# Altium project ControlBoard.PrjPcb
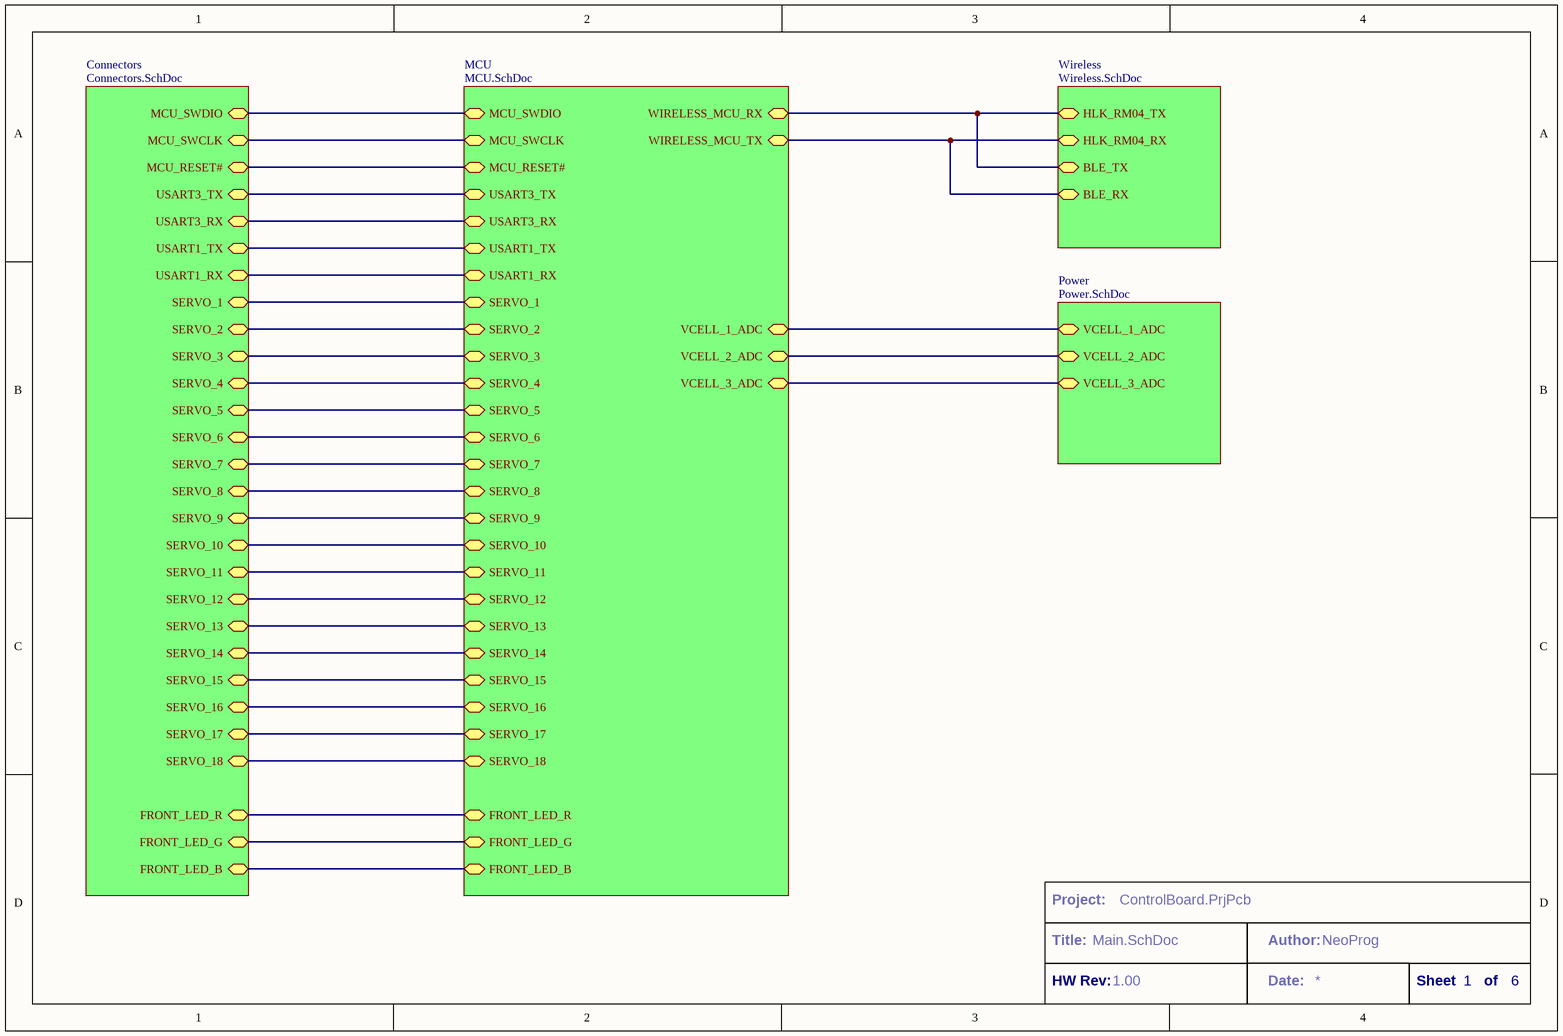
[diagram p0: Main.SchDoc]
ProjectAuthor: NeoProg; ProjectRevision: 1.00; ProjectStatus: D
5 sheets, 76 parts. Net scope: hierarchical (ports join the sheet entries above them; power ports are global).
Board file: PCB.PcbDoc
Sheets:
  Main.SchDoc
    Connectors = Connectors.SchDoc
    MCU = MCU.SchDoc
    Power = Power.SchDoc
    Wireless = Wireless.SchDoc

## Sheet Main.SchDoc
size A4; DocumentNumber: 1; SheetNumber: 1; SheetTotal: 6

### Sub-sheets
Connectors = Connectors.SchDoc: MCU_SWDIO, MCU_SWCLK, MCU_RESET#, USART3_TX, USART3_RX, USART1_TX, USART1_RX, SERVO_1, SERVO_2, SERVO_3, SERVO_4, SERVO_5, SERVO_6, SERVO_7, SERVO_8, SERVO_9, SERVO_10, SERVO_11, SERVO_12, SERVO_13, SERVO_14, SERVO_15, SERVO_16, SERVO_17, SERVO_18, FRONT_LED_B, FRONT_LED_G, FRONT_LED_R
MCU = MCU.SchDoc: MCU_SWDIO, MCU_SWCLK, MCU_RESET#, USART3_TX, USART3_RX, USART1_TX, USART1_RX, SERVO_1, SERVO_2, SERVO_3, SERVO_4, SERVO_5, SERVO_6, SERVO_7, SERVO_8, SERVO_9, SERVO_10, SERVO_11, SERVO_12, SERVO_13, SERVO_14, SERVO_15, SERVO_16, SERVO_17, SERVO_18, WIRELESS_MCU_TX, WIRELESS_MCU_RX, VCELL_1_ADC, VCELL_3_ADC, VCELL_2_ADC, FRONT_LED_R, FRONT_LED_G, FRONT_LED_B
Power = Power.SchDoc: VCELL_1_ADC, VCELL_3_ADC, VCELL_2_ADC
Wireless = Wireless.SchDoc: HLK_RM04_TX, HLK_RM04_RX, BLE_RX, BLE_TX

### Nets
BLE_RX: sheet MCU/WIRELESS_MCU_TX, sheet Wireless/HLK_RM04_RX, sheet Wireless/BLE_RX
BLE_TX: sheet MCU/WIRELESS_MCU_RX, sheet Wireless/HLK_RM04_TX, sheet Wireless/BLE_TX
FRONT_LED_B: sheet Connectors/FRONT_LED_B, sheet MCU/FRONT_LED_B
FRONT_LED_G: sheet Connectors/FRONT_LED_G, sheet MCU/FRONT_LED_G
FRONT_LED_R: sheet Connectors/FRONT_LED_R, sheet MCU/FRONT_LED_R
MCU_RESET#: sheet Connectors/MCU_RESET#, sheet MCU/MCU_RESET#
MCU_SWCLK: sheet Connectors/MCU_SWCLK, sheet MCU/MCU_SWCLK
MCU_SWDIO: sheet Connectors/MCU_SWDIO, sheet MCU/MCU_SWDIO
SERVO_1: sheet Connectors/SERVO_1, sheet MCU/SERVO_1
SERVO_2: sheet Connectors/SERVO_2, sheet MCU/SERVO_2
SERVO_3: sheet Connectors/SERVO_3, sheet MCU/SERVO_3
SERVO_4: sheet Connectors/SERVO_4, sheet MCU/SERVO_4
SERVO_5: sheet Connectors/SERVO_5, sheet MCU/SERVO_5
SERVO_6: sheet Connectors/SERVO_6, sheet MCU/SERVO_6
SERVO_7: sheet Connectors/SERVO_7, sheet MCU/SERVO_7
SERVO_8: sheet Connectors/SERVO_8, sheet MCU/SERVO_8
SERVO_9: sheet Connectors/SERVO_9, sheet MCU/SERVO_9
SERVO_10: sheet Connectors/SERVO_10, sheet MCU/SERVO_10
SERVO_11: sheet Connectors/SERVO_11, sheet MCU/SERVO_11
SERVO_12: sheet Connectors/SERVO_12, sheet MCU/SERVO_12
SERVO_13: sheet Connectors/SERVO_13, sheet MCU/SERVO_13
SERVO_14: sheet Connectors/SERVO_14, sheet MCU/SERVO_14
SERVO_15: sheet Connectors/SERVO_15, sheet MCU/SERVO_15
SERVO_16: sheet Connectors/SERVO_16, sheet MCU/SERVO_16
SERVO_17: sheet Connectors/SERVO_17, sheet MCU/SERVO_17
SERVO_18: sheet Connectors/SERVO_18, sheet MCU/SERVO_18
USART1_RX: sheet Connectors/USART1_RX, sheet MCU/USART1_RX
USART1_TX: sheet Connectors/USART1_TX, sheet MCU/USART1_TX
USART3_RX: sheet Connectors/USART3_RX, sheet MCU/USART3_RX
USART3_TX: sheet Connectors/USART3_TX, sheet MCU/USART3_TX
VCELL_1_ADC: sheet MCU/VCELL_1_ADC, sheet Power/VCELL_1_ADC
VCELL_2_ADC: sheet MCU/VCELL_2_ADC, sheet Power/VCELL_2_ADC
VCELL_3_ADC: sheet MCU/VCELL_3_ADC, sheet Power/VCELL_3_ADC

### Notes on the sheet
- Project:
- Title:
- HW Rev:
- Author:
- Date:
- Sheet
- of

## Sheet Connectors.SchDoc
size A4
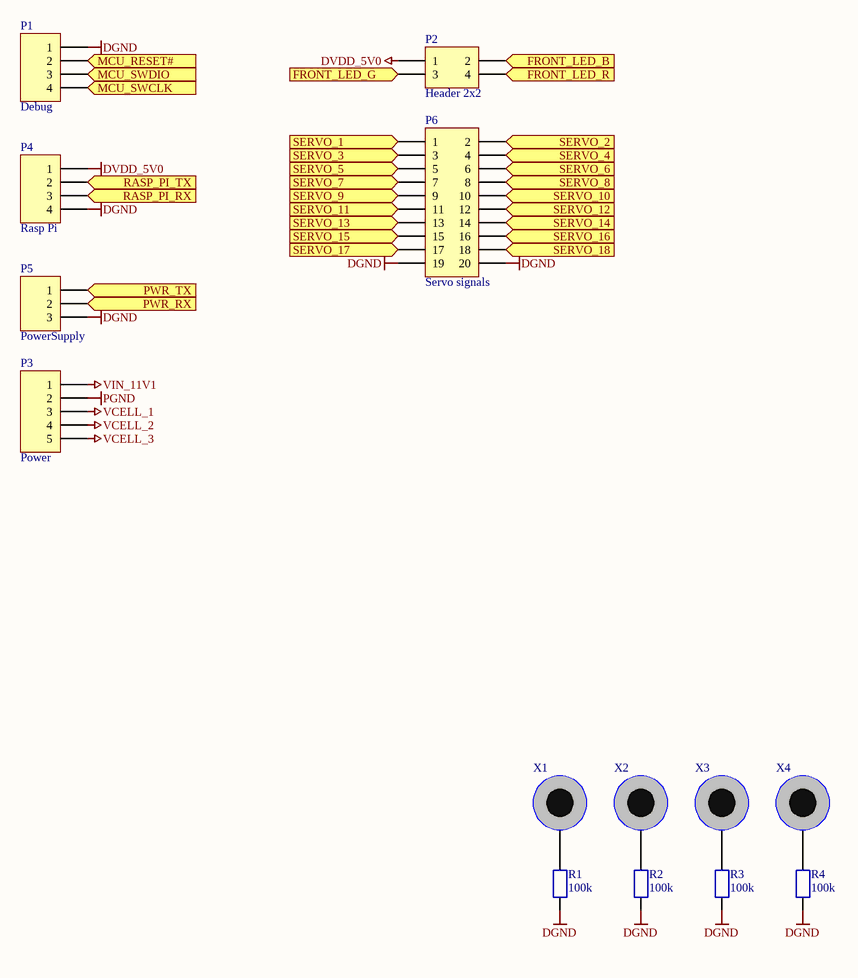
[diagram p1: Connectors.SchDoc]

### Parts
P1  Debug  [HDR_SMD_1X4_1.50]
P2  Header 2x2  [HDR_M_2X2_2.54]
P3  Power  [HDR_M_1X5_2.54_OUTLINE]
P4  Rasp Pi  [HDR_M_1X4_2.54]
P5  PowerSupply  [HDR_M_1X3_2.54]
P6  Servo signals  [HDR_M_2X10_2.54_OUTLINE]
R1  100k  [R_0603/1608]
R2  100k  [R_0603/1608]
R3  100k  [R_0603/1608]
R4  100k  [R_0603/1608]
X1  Mounting hole  [HOLE_M2_D4.0/2.5]  (value not drawn)  (no BOM)
X2  Mounting hole  [HOLE_M2_D4.0/2.5]  (value not drawn)  (no BOM)
X3  Mounting hole  [HOLE_M2_D4.0/2.5]  (value not drawn)  (no BOM)
X4  Mounting hole  [HOLE_M2_D4.0/2.5]  (value not drawn)  (no BOM)

### Ports
FRONT_LED_B, FRONT_LED_G, FRONT_LED_R, MCU_RESET#, MCU_SWCLK, MCU_SWDIO, PWR_RX, PWR_TX, RASP_PI_RX, RASP_PI_TX, SERVO_1, SERVO_2, SERVO_3, SERVO_4, SERVO_5, SERVO_6, SERVO_7, SERVO_8, SERVO_9, SERVO_10, SERVO_11, SERVO_12, SERVO_13, SERVO_14, SERVO_15, SERVO_16, SERVO_17, SERVO_18

### Nets
DGND: P1.1 P4.4 P5.3 P6.19 P6.20 R1.2 R2.2 R3.2 R4.2
DVDD_5V0: P2.1 P4.1
PGND: P3.2
VCELL_1: P3.3
VCELL_2: P3.4
VCELL_3: P3.5
VIN_11V1: P3.1
FRONT_LED_B: P2.2 ; port FRONT_LED_B
FRONT_LED_G: P2.3 ; port FRONT_LED_G
FRONT_LED_R: P2.4 ; port FRONT_LED_R
MCU_RESET#: P1.2 ; port MCU_RESET#
MCU_SWCLK: P1.4 ; port MCU_SWCLK
MCU_SWDIO: P1.3 ; port MCU_SWDIO
PWR_RX: P5.2 ; port PWR_RX
PWR_TX: P5.1 ; port PWR_TX
RASP_PI_RX: P4.3 ; port RASP_PI_RX
RASP_PI_TX: P4.2 ; port RASP_PI_TX
SERVO_1: P6.1 ; port SERVO_1
SERVO_2: P6.2 ; port SERVO_2
SERVO_3: P6.3 ; port SERVO_3
SERVO_4: P6.4 ; port SERVO_4
SERVO_5: P6.5 ; port SERVO_5
SERVO_6: P6.6 ; port SERVO_6
SERVO_7: P6.7 ; port SERVO_7
SERVO_8: P6.8 ; port SERVO_8
SERVO_9: P6.9 ; port SERVO_9
SERVO_10: P6.10 ; port SERVO_10
SERVO_11: P6.11 ; port SERVO_11
SERVO_12: P6.12 ; port SERVO_12
SERVO_13: P6.13 ; port SERVO_13
SERVO_14: P6.14 ; port SERVO_14
SERVO_15: P6.15 ; port SERVO_15
SERVO_16: P6.16 ; port SERVO_16
SERVO_17: P6.17 ; port SERVO_17
SERVO_18: P6.18 ; port SERVO_18
NetR1_1: R1.1 X1.1
NetR2_1: R2.1 X2.1
NetR3_1: R3.1 X3.1
NetR4_1: R4.1 X4.1

### Notes on the sheet
- Project:
- Title:
- HW Rev:
- Author:
- Date:
- Sheet
- of

### Library data of the parts
P1 P4 = Header 4: Header, 4-Pin; LatestRevisionDate: 17-Jul-2002; LatestRevisionNote: Re-released for DXP Platform.; Publisher: Altium Limited
P2 = Header 2x2: Header, 2-Pin; LatestRevisionDate: 17-Jul-2002; LatestRevisionNote: Re-released for DXP Platform.; Publisher: Altium Limited
P3 = Header 5: Header, 5-Pin; LatestRevisionDate: 17-Jul-2002; LatestRevisionNote: Re-released for DXP Platform.; Publisher: Altium Limited
P5 = Header 3: Header, 3-Pin; LatestRevisionDate: 17-Jul-2002; LatestRevisionNote: Re-released for DXP Platform.; Publisher: Altium Limited
P6 = Header 2x10: Header, 20-Pin; LatestRevisionDate: 17-Jul-2002; LatestRevisionNote: Re-released for DXP Platform.; Publisher: Altium Limited
R1-R4 = Resistor
X1-X4 = Mounting hole: Hole for screw M3, outline D6

## Sheet MCU.SchDoc
size A4
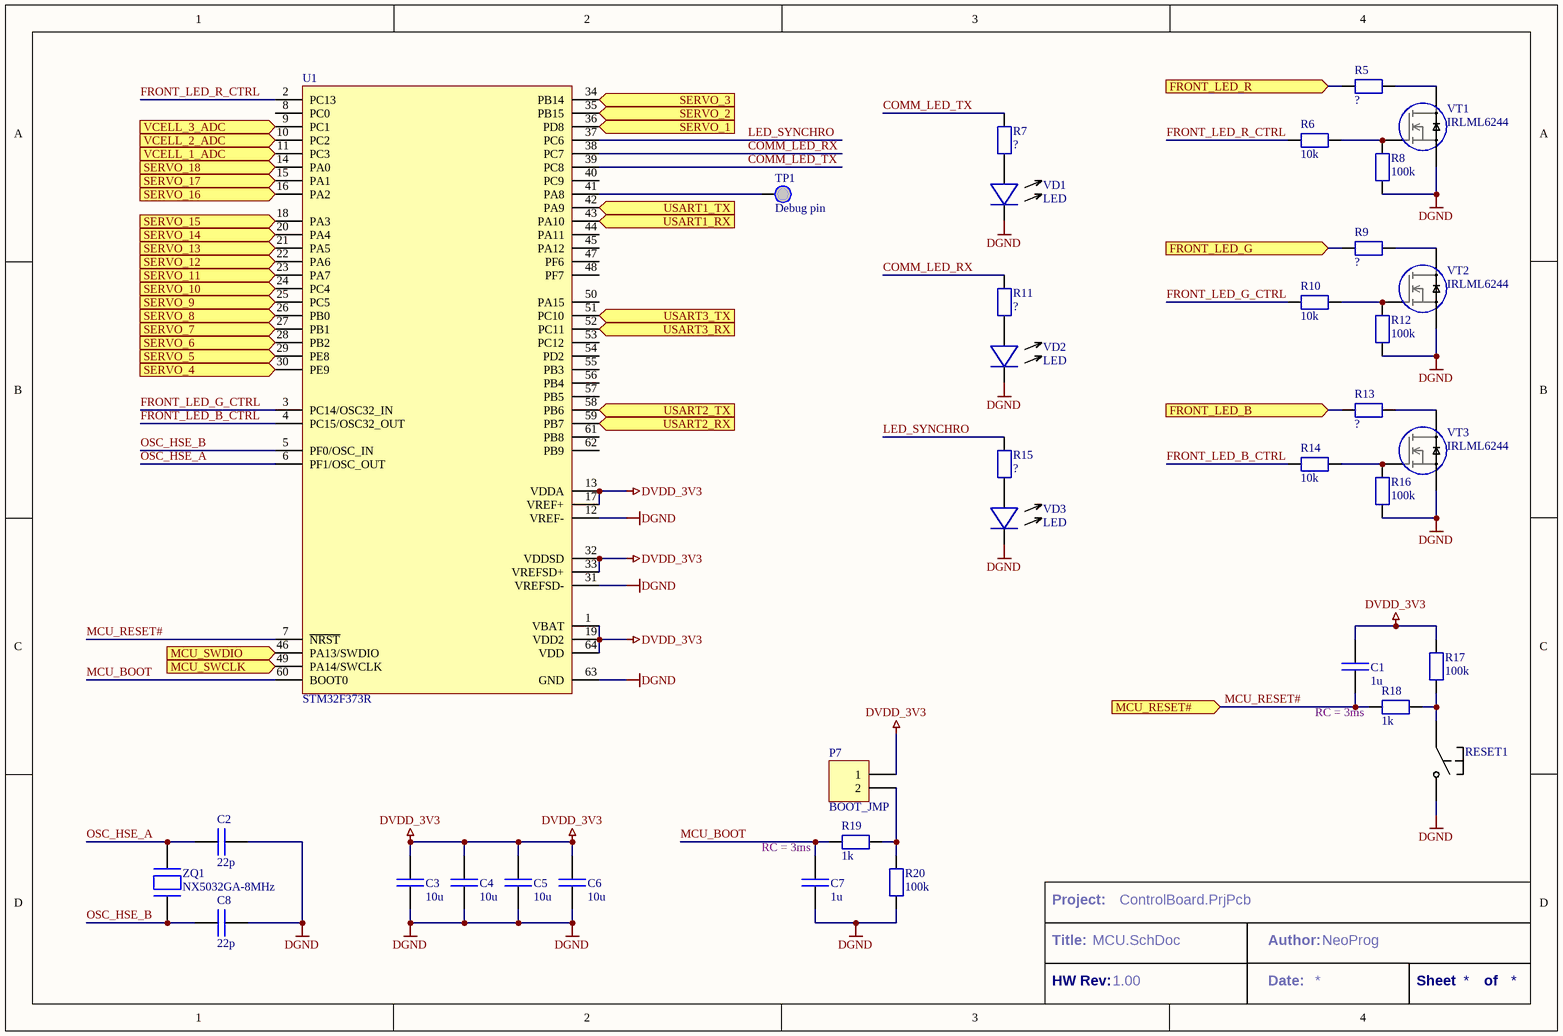
[diagram p2: MCU.SchDoc]

### Parts
C1  1u  [C_0603/1608]
C2  22p  [C_0603/1608]
C3  10u  [C_0603/1608]
C4  10u  [C_0603/1608]
C5  10u  [C_0603/1608]
C6  10u  [C_0603/1608]
C7  1u  [C_0603/1608]
C8  22p  [C_0603/1608]
P7  BOOT_JMP  [HDR_SMD_1X2_1.50]
R5  ?  [R_0603/1608]
R6  10k  [R_0603/1608]
R7  ?  [R_0603/1608]
R8  100k  [R_0603/1608]
R9  ?  [R_0603/1608]
R10  10k  [R_0603/1608]
R11  ?  [R_0603/1608]
R12  100k  [R_0603/1608]
R13  ?  [R_0603/1608]
R14  10k  [R_0603/1608]
R15  ?  [R_0603/1608]
R16  100k  [R_0603/1608]
R17  100k  [R_0603/1608]
R18  1k  [R_0603/1608]
R19  1k  [R_0603/1608]
R20  100k  [R_0603/1608]
RESET1  Button SPST  [BUTTON_SMD_6x6]  (value not drawn)
TP1  Debug pin  [TP_SMD_D1.00]  (no BOM)
U1  STM32F373R  [LQFP64]
VD1  LED  [LED_0603/1608]
VD2  LED  [LED_0603/1608]
VD3  LED  [LED_0603/1608]
VT1  IRLML6244  [SOT23-3]
VT2  IRLML6244  [SOT23-3]
VT3  IRLML6244  [SOT23-3]
ZQ1  NX5032GA-8MHz  [OSC_2PINS SMD]

### Ports
FRONT_LED_B, FRONT_LED_G, FRONT_LED_R, MCU_RESET#, MCU_SWCLK, MCU_SWDIO, SERVO_1, SERVO_2, SERVO_3, SERVO_4, SERVO_5, SERVO_6, SERVO_7, SERVO_8, SERVO_9, SERVO_10, SERVO_11, SERVO_12, SERVO_13, SERVO_14, SERVO_15, SERVO_16, SERVO_17, SERVO_18, USART1_RX, USART1_TX, USART2_RX, USART2_TX, USART3_RX, USART3_TX, VCELL_1_ADC, VCELL_2_ADC, VCELL_3_ADC

### Nets
DGND: C2.2 C3.2 C4.2 C5.2 C6.2 C7.2 C8.2 R8.1 R12.1 R16.1 R20.2 RESET1.2 U1.12(VREF-) U1.31(VREFSD-) U1.63(GND) VD1.C(Cathode) VD2.C(Cathode) VD3.C(Cathode) VT1.S VT2.S VT3.S
DVDD_3V3: C1.1 C3.1 C4.1 C5.1 C6.1 P7.1 R17.1 U1.1(VBAT) U1.13(VDDA) U1.17(VREF+) U1.19(VDD2) U1.32(VDDSD) U1.33(VREFSD+) U1.64(VDD)
COMM_LED_RX: R11.1 U1.38(PC7)
COMM_LED_TX: R7.1 U1.39(PC8)
FRONT_LED_B: R13.2 ; port FRONT_LED_B
FRONT_LED_B_CTRL: R14.2 U1.4(PC15/OSC32_OUT)
FRONT_LED_G: R9.2 ; port FRONT_LED_G
FRONT_LED_G_CTRL: R10.2 U1.3(PC14/OSC32_IN)
FRONT_LED_R: R5.2 ; port FRONT_LED_R
FRONT_LED_R_CTRL: R6.2 U1.2(PC13)
LED_SYNCHRO: R15.1 U1.37(PC6)
MCU_BOOT: C7.1 R19.2 U1.60(BOOT0)
MCU_RESET#: C1.2 R18.2 U1.7(~{NRST}) ; port MCU_RESET#
MCU_SWCLK: U1.49(PA14/SWCLK) ; port MCU_SWCLK
MCU_SWDIO: U1.46(PA13/SWDIO) ; port MCU_SWDIO
OSC_HSE_A: C2.1 U1.6(PF1/OSC_OUT) ZQ1.2
OSC_HSE_B: C8.1 U1.5(PF0/OSC_IN) ZQ1.1
SERVO_1: U1.36(PD8) ; port SERVO_1
SERVO_2: U1.35(PB15) ; port SERVO_2
SERVO_3: U1.34(PB14) ; port SERVO_3
SERVO_4: U1.30(PE9) ; port SERVO_4
SERVO_5: U1.29(PE8) ; port SERVO_5
SERVO_6: U1.28(PB2) ; port SERVO_6
SERVO_7: U1.27(PB1) ; port SERVO_7
SERVO_8: U1.26(PB0) ; port SERVO_8
SERVO_9: U1.25(PC5) ; port SERVO_9
SERVO_10: U1.24(PC4) ; port SERVO_10
SERVO_11: U1.23(PA7) ; port SERVO_11
SERVO_12: U1.22(PA6) ; port SERVO_12
SERVO_13: U1.21(PA5) ; port SERVO_13
SERVO_14: U1.20(PA4) ; port SERVO_14
SERVO_15: U1.18(PA3) ; port SERVO_15
SERVO_16: U1.16(PA2) ; port SERVO_16
SERVO_17: U1.15(PA1) ; port SERVO_17
SERVO_18: U1.14(PA0) ; port SERVO_18
USART1_RX: U1.43(PA10) ; port USART1_RX
USART1_TX: U1.42(PA9) ; port USART1_TX
USART2_RX: U1.59(PB7) ; port USART2_RX
USART2_TX: U1.58(PB6) ; port USART2_TX
USART3_RX: U1.52(PC11) ; port USART3_RX
USART3_TX: U1.51(PC10) ; port USART3_TX
VCELL_1_ADC: U1.11(PC3) ; port VCELL_1_ADC
VCELL_2_ADC: U1.10(PC2) ; port VCELL_2_ADC
VCELL_3_ADC: U1.9(PC1) ; port VCELL_3_ADC
NetP7_2: P7.2 R19.1 R20.1
NetR5_1: R5.1 VT1.D
NetR6_1: R6.1 R8.2 VT1.G
NetR7_2: R7.2 VD1.A(Anode)
NetR9_1: R9.1 VT2.D
NetR10_1: R10.1 R12.2 VT2.G
NetR11_2: R11.2 VD2.A(Anode)
NetR13_1: R13.1 VT3.D
NetR14_1: R14.1 R16.2 VT3.G
NetR15_2: R15.2 VD3.A(Anode)
NetR17_2: R17.2 R18.1 RESET1.1
NetTP1_1: TP1.1 U1.41(PA8)

Not connected (* = marked no-connect by the designer): U1 0(EP) 8(PC0) 40(PC9) 44(PA11) 45(PA12) 47(PF6) 48(PF7) 50(PA15) 53(PC12) 54(PD2) 55(PB3) 56(PB4) 57(PB5) 61(PB8) 62(PB9)

### Notes on the sheet
- (near R18) RC = 3ms
- RC = 3ms
- Project:
- Title:
- HW Rev:
- Author:
- Date:
- Sheet
- of

### Library data of the parts
C1-C8 = Capacitor: Non-polarized capacitor
P7 = Header 2: Header, 2-Pin; LatestRevisionDate: 17-Jul-2002; LatestRevisionNote: Re-released for DXP Platform.; Publisher: Altium Limited
R5-R20 = Resistor
RESET1 = Button SPST: Button SPST, without fixation
TP1 = Test point
U1 = STM32F373R: 32-bit Cortex-M3
VT1-VT3 = MOSFET N: pin to pad: D>3 G>1 S>2
ZQ1 = Crystal oscillator

## Sheet Power.SchDoc
size A4
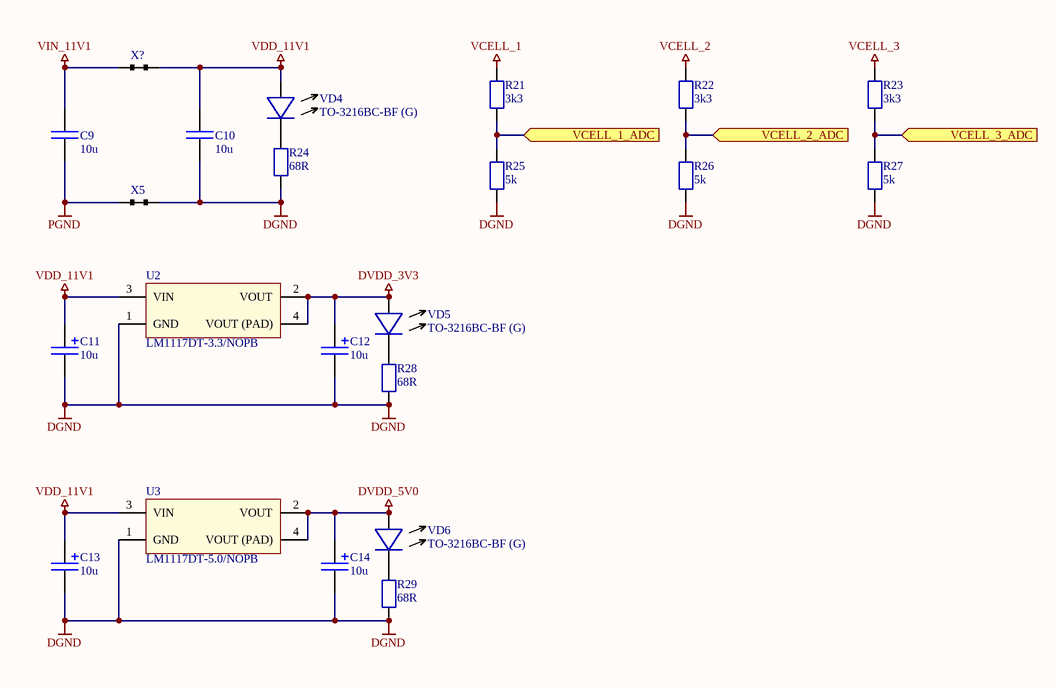
[diagram p3: Power.SchDoc]

### Parts
C9  10u  [C_1206/3216]
C10  10u  [C_1206/3216]
C11  10u  [TECAP_TYPE_C]
C12  10u  [TECAP_TYPE_B]
C13  10u  [TECAP_TYPE_C]
C14  10u  [TECAP_TYPE_B]
R21  3k3  [R_0603/1608]
R22  3k3  [R_0603/1608]
R23  3k3  [R_0603/1608]
R24  68R  [R_0603/1608]
R25  5k  [R_0603/1608]
R26  5k  [R_0603/1608]
R27  5k  [R_0603/1608]
R28  68R  [R_0603/1608]
R29  68R  [R_0603/1608]
U2  LM1117DT-3.3/NOPB  [TO252AA/DPAK]
U3  LM1117DT-5.0/NOPB  [TO252AA/DPAK]
VD4  TO-3216BC-BF (G)  [LED_0603/1608]
VD5  TO-3216BC-BF (G)  [LED_0603/1608]
VD6  TO-3216BC-BF (G)  [LED_0603/1608]
X5  (no value)  [NET_TIE_1.0]  (net tie, no BOM)
X?  (no value)  [NET_TIE_1.0]  (net tie, no BOM)

### Ports
VCELL_1_ADC, VCELL_2_ADC, VCELL_3_ADC

### Nets
DGND: C10.1 C11.2(NEG) C12.2(NEG) C13.2(NEG) C14.2(NEG) R24.1 R25.1 R26.1 R27.1 R28.1 R29.1 U2.1(GND) U3.1(GND) X5.2
DVDD_3V3: C12.1(POS) U2.2(VOUT) U2.4(VOUT_(PAD)) VD5.A(Anode)
DVDD_5V0: C14.1(POS) U3.2(VOUT) U3.4(VOUT_(PAD)) VD6.A(Anode)
PGND: C9.1 X5.1
VCELL_1: R21.2
VCELL_2: R22.2
VCELL_3: R23.2
VDD_11V1: C10.2 C11.1(POS) C13.1(POS) U2.3(VIN) U3.3(VIN) VD4.A(Anode) X?.2
VIN_11V1: C9.2 X?.1
VCELL_1_ADC: R21.1 R25.2 ; port VCELL_1_ADC
VCELL_2_ADC: R22.1 R26.2 ; port VCELL_2_ADC
VCELL_3_ADC: R23.1 R27.2 ; port VCELL_3_ADC
NetR24_2: R24.2 VD4.C(Cathode)
NetR28_2: R28.2 VD5.C(Cathode)
NetR29_2: R29.2 VD6.C(Cathode)

### Library data of the parts
C9 C10 = Capacitor: Non-polarized capacitor
C11-C14 = Capacitor polar: Polarized capacitor
R21-R29 = Resistor
U2 U3 = LM1117: LDO voltage regulator; pin to pad: 2>3 3>2 4>3
VD4-VD6 = LED
X5 X? = Net tie

## Sheet Wireless.SchDoc
size A4
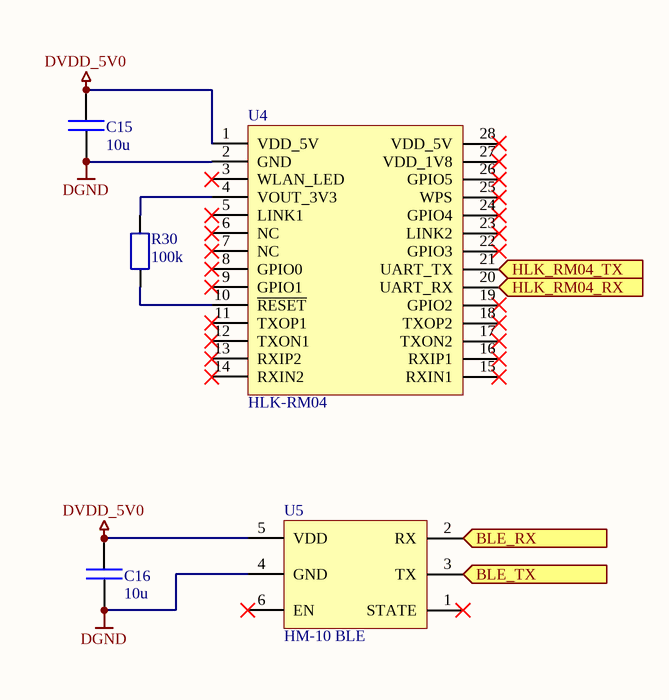
[diagram p4: Wireless.SchDoc]

### Parts
C15  10u  [C_1206/3216]
C16  10u  [C_1206/3216]
R30  100k  [R_0603/1608]
U4  HLK-RM04  [HLK-RM04]
U5  HM-10 BLE  [HM-10]

### Ports
BLE_RX, BLE_TX, HLK_RM04_RX, HLK_RM04_TX

### Nets
DGND: C15.2 C16.2 U4.2(GND) U5.4(GND)
DVDD_5V0: C15.1 C16.1 U4.1(VDD_5V) U5.5(VDD)
BLE_RX: U4.20(UART_RX) U5.2(RX) ; port HLK_RM04_RX, port BLE_RX
BLE_TX: U4.21(UART_TX) U5.3(TX) ; port HLK_RM04_TX, port BLE_TX
NetR30_1: R30.1 U4.4(VOUT_3V3)
NetR30_2: R30.2 U4.10(~{RESET})

Not connected (* = marked no-connect by the designer): U4 0(EP) 3(WLAN_LED)* 5(LINK1)* 6(NC)* 7(NC)* 8(GPIO0)* 9(GPIO1)* 11(TXOP1)* 12(TXON1)* 13(RXIP2)* 14(RXIN2)* 15(RXIN1)* 16(RXIP1)* 17(TXON2)* 18(TXOP2)* 19(GPIO2)* 22(GPIO3)* 23(LINK2)* 24(GPIO4)* 25(WPS)* 26(GPIO5)* 27(VDD_1V8)* 28(VDD_5V)*; U5 0(EP) 1(STATE)* 6(EN)*

### Library data of the parts
C15 C16 = Capacitor: Non-polarized capacitor
R30 = Resistor
U4 = HLK-RM04: WIFI-UART bridge
U5 = HM-10 BLE: BLE-UART bridge

## Nets that join several sheets
DGND: Connectors (9 pins), MCU (21 pins), Power (14 pins), Wireless (C15.2 C16.2 U4.2 U5.4)
DVDD_3V3: MCU (14 pins), Power (C12.1 U2.2 U2.4 VD5.A)
DVDD_5V0: Connectors (P2.1 P4.1), Power (C14.1 U3.2 U3.4 VD6.A), Wireless (C15.1 C16.1 U4.1 U5.5)
PGND: Connectors (P3.2), Power (C9.1 X5.1)
VCELL_1: Connectors (P3.3), Power (R21.2)
VCELL_2: Connectors (P3.4), Power (R22.2)
VCELL_3: Connectors (P3.5), Power (R23.2)
VIN_11V1: Connectors (P3.1), Power (C9.2 X?.1)
FRONT_LED_B: Connectors (P2.2), MCU (R13.2)
FRONT_LED_G: Connectors (P2.3), MCU (R9.2)
FRONT_LED_R: Connectors (P2.4), MCU (R5.2)
MCU_RESET#: Connectors (P1.2), MCU (C1.2 R18.2 U1.7)
MCU_SWCLK: Connectors (P1.4), MCU (U1.49)
MCU_SWDIO: Connectors (P1.3), MCU (U1.46)
SERVO_1: Connectors (P6.1), MCU (U1.36)
SERVO_2: Connectors (P6.2), MCU (U1.35)
SERVO_3: Connectors (P6.3), MCU (U1.34)
SERVO_4: Connectors (P6.4), MCU (U1.30)
SERVO_5: Connectors (P6.5), MCU (U1.29)
SERVO_6: Connectors (P6.6), MCU (U1.28)
SERVO_7: Connectors (P6.7), MCU (U1.27)
SERVO_8: Connectors (P6.8), MCU (U1.26)
SERVO_9: Connectors (P6.9), MCU (U1.25)
SERVO_10: Connectors (P6.10), MCU (U1.24)
SERVO_11: Connectors (P6.11), MCU (U1.23)
SERVO_12: Connectors (P6.12), MCU (U1.22)
SERVO_13: Connectors (P6.13), MCU (U1.21)
SERVO_14: Connectors (P6.14), MCU (U1.20)
SERVO_15: Connectors (P6.15), MCU (U1.18)
SERVO_16: Connectors (P6.16), MCU (U1.16)
SERVO_17: Connectors (P6.17), MCU (U1.15)
SERVO_18: Connectors (P6.18), MCU (U1.14)
VCELL_1_ADC: MCU (U1.11), Power (R21.1 R25.2)
VCELL_2_ADC: MCU (U1.10), Power (R22.1 R26.2)
VCELL_3_ADC: MCU (U1.9), Power (R23.1 R27.2)

## Assembly variants
Base: all parts fitted